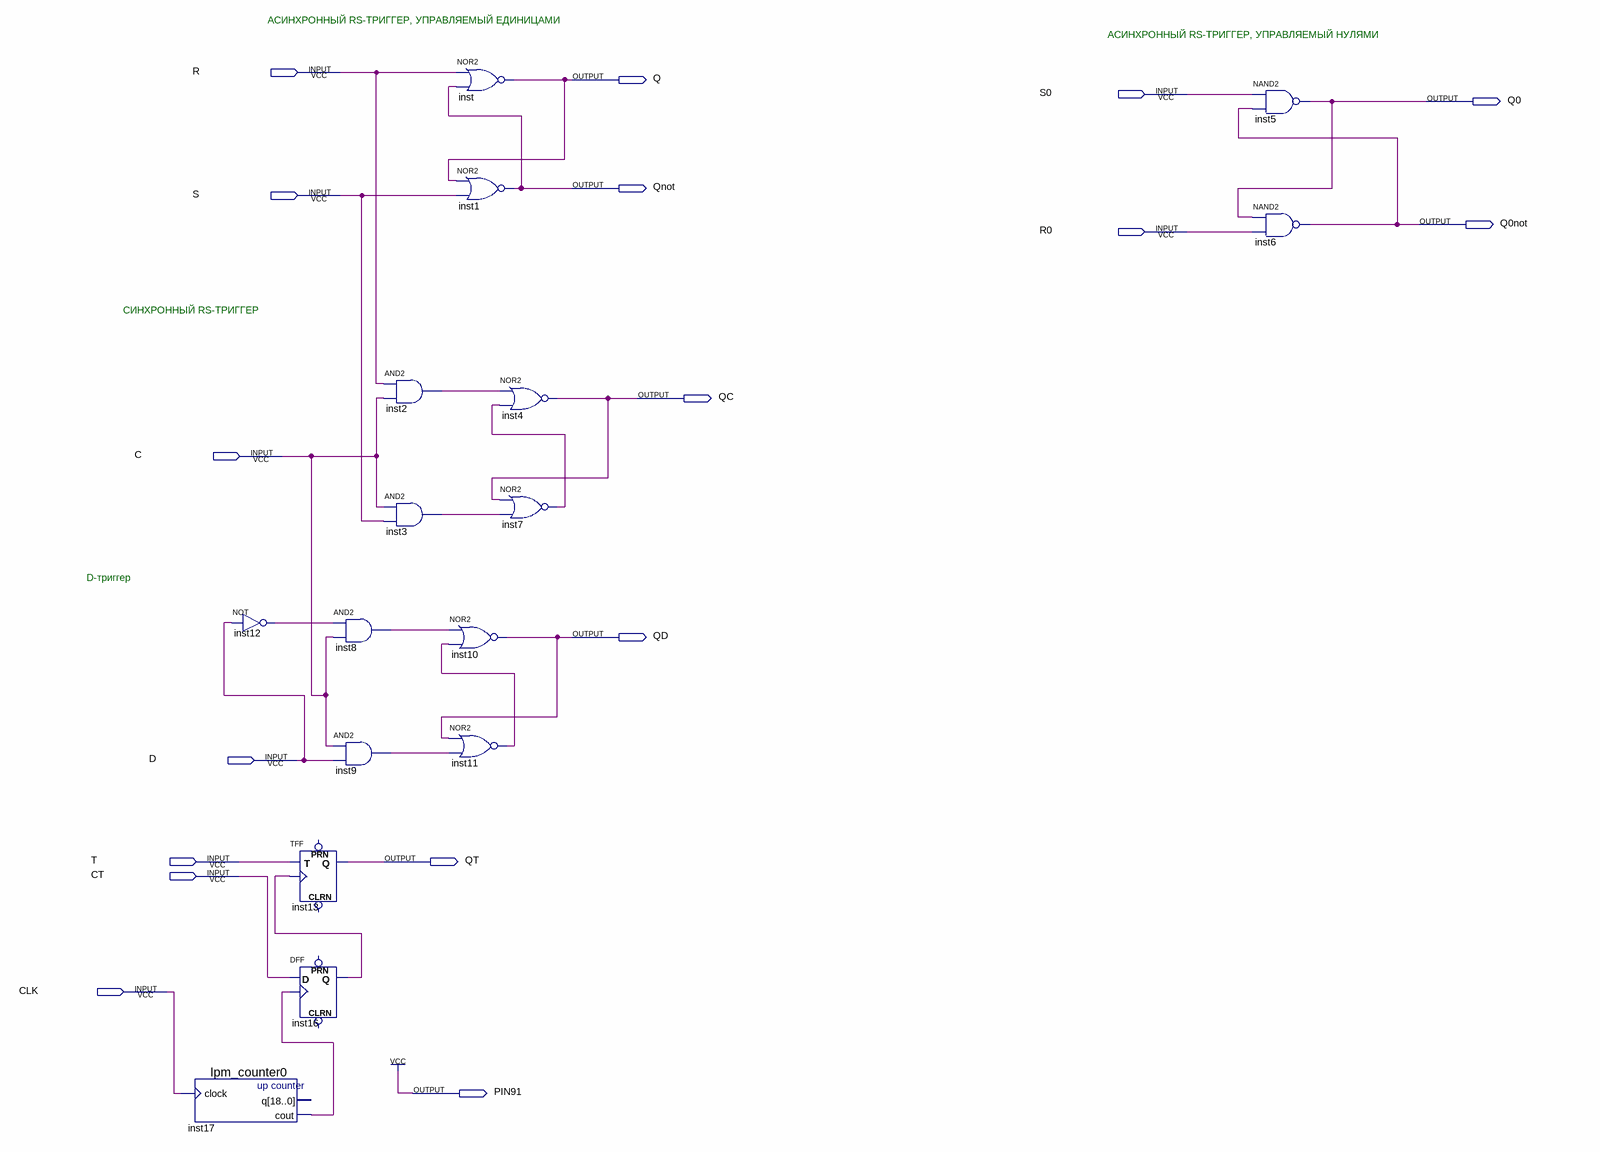
[diagram p0: schematic sheet]
// Quartus schematic Triggers.bdf as structural Verilog: 16 symbols, 17 pins
module Triggers (
  input  R,
  input  S0,
  input  S,
  input  R0,
  input  C,
  input  D,
  input  T,
  input  CT,
  input  CLK,
  output Q,
  output Q0,
  output Qnot,
  output Q0not,
  output QC,
  output QD,
  output QT,
  output PIN91
);

  wire inst2_out, inst3_out, inst7_out, inst8_out, inst9_out, inst11_out, inst12_out, inst16_q, inst17_cout;

  not inst12 (inst12_out, D);
  lpm_counter0 inst17 (.clock(CLK), .cout(inst17_cout));  // open: q
  TFF inst13 (.T(T), .CLK(inst16_q), .Q(QT));  // open: PRN, CLRN
  DFF inst16 (.CLK(inst17_cout), .D(CT), .Q(inst16_q));  // open: CLRN, PRN
  and inst8 (inst8_out, inst12_out, C);
  and inst9 (inst9_out, C, D);
  and inst2 (inst2_out, R, C);
  and inst3 (inst3_out, C, S);
  nor inst (Q, R, Qnot);
  nor inst1 (Qnot, Q, S);
  nor inst10 (QD, inst8_out, inst11_out);
  nor inst11 (inst11_out, QD, inst9_out);
  nor inst4 (QC, inst2_out, inst7_out);
  nor inst7 (inst7_out, QC, inst3_out);
  nand inst5 (Q0, S0, Q0not);
  nand inst6 (Q0not, Q0, R0);

  assign PIN91 = 1'b1;

  // Notes on the sheet:
  //   АСИНХРОННЫЙ RS-ТРИГГЕР, УПРАВЛЯЕМЫЙ ЕДИНИЦАМИ
  //   АСИНХРОННЫЙ RS-ТРИГГЕР, УПРАВЛЯЕМЫЙ НУЛЯМИ
  //   СИНХРОННЫЙ RS-ТРИГГЕР
  //   D-триггер
endmodule
